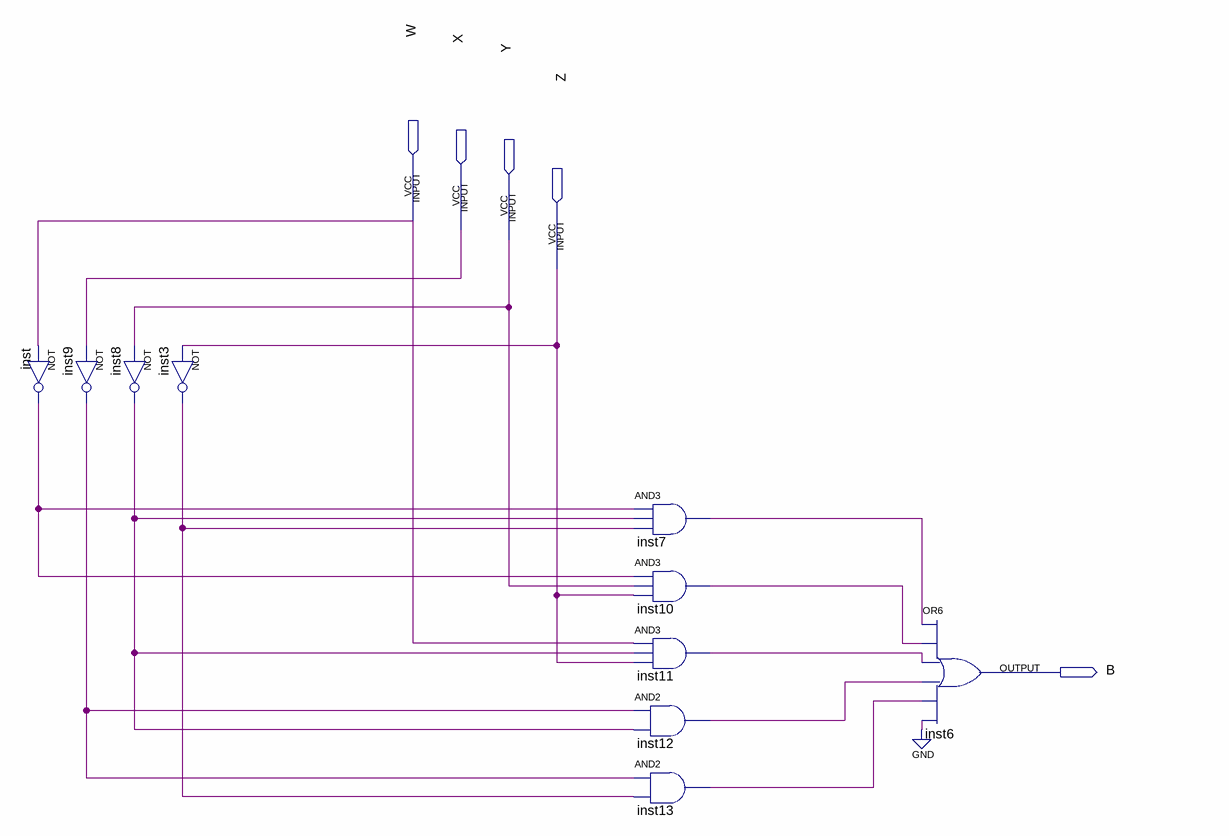
[diagram p0: schematic sheet]
// Quartus schematic SEG_B.bdf as structural Verilog: 10 symbols, 5 pins
module SEG_B (
  input  W,
  input  X,
  input  Y,
  input  Z,
  output B
);

  wire inst3_out, inst7_out, inst8_out, inst9_out, inst10_out, inst11_out, inst12_out, inst13_out, inst_out;

  not inst (inst_out, W);
  not inst8 (inst8_out, Y);
  not inst9 (inst9_out, X);
  not inst3 (inst3_out, Z);
  and inst7 (inst7_out, inst_out, inst8_out, inst3_out);
  and inst10 (inst10_out, inst_out, Y, Z);
  and inst11 (inst11_out, W, inst8_out, Z);
  and inst12 (inst12_out, inst9_out, inst8_out);
  and inst13 (inst13_out, inst9_out, inst3_out);
  or inst6 (B, inst7_out, inst10_out, inst11_out, inst12_out, inst13_out, 1'b0);
endmodule
